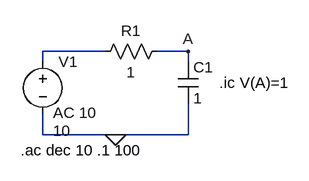
[diagram p0: schematic Lab1.asc]
Lab1.asc, the LTspice schematic file:
Version 4
SHEET 1 880 680
WIRE 144 144 48 144
WIRE 272 144 224 144
WIRE 48 160 48 144
WIRE 272 160 272 144
WIRE 48 272 48 240
WIRE 160 272 48 272
WIRE 272 272 272 224
WIRE 272 272 160 272
FLAG 160 272 0
FLAG 272 144 A
SYMBOL cap 256 160 R0
SYMATTR InstName C1
SYMATTR Value 1
SYMBOL res 240 128 R90
WINDOW 0 0 56 VBottom 2
WINDOW 3 32 56 VTop 2
SYMATTR InstName R1
SYMATTR Value 1
SYMBOL voltage 48 144 R0
WINDOW 3 16 122 Left 2
WINDOW 123 16 94 Left 2
WINDOW 39 0 0 Left 0
SYMATTR InstName V1
SYMATTR Value 10
SYMATTR Value2 AC 10
TEXT 320 192 Left 2 !.ic V(A)=1
TEXT 14 296 Left 2 !.ac dec 10 .1 100

The netlist it stands for:
* Lab1.asc
C1 A 0 1
R1 A N001 1
V1 N001 0 10 AC 10
.ic V(A)=1
.ac dec 10 .1 100
.backanno
.end